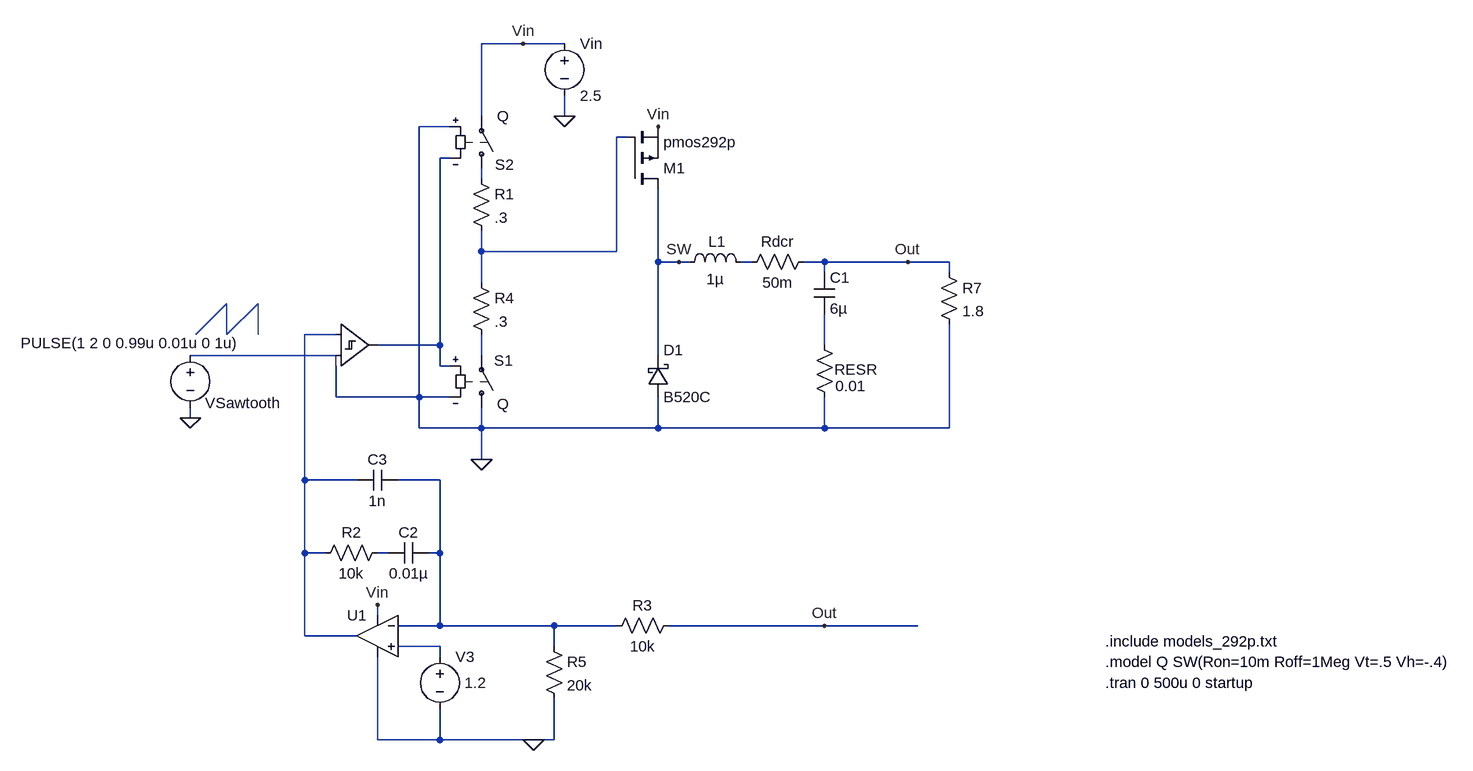
[diagram p0: schematic Lec18_Buck.asc]
Lec18_Buck.asc, the LTspice schematic file:
Version 4
SHEET 1 2044 1956
WIRE 528 -272 464 -272
WIRE 592 -272 528 -272
WIRE 464 -160 464 -272
WIRE 592 -160 592 -192
WIRE 416 -144 368 -144
WIRE 688 -128 672 -128
WIRE 416 -96 400 -96
WIRE 464 -64 464 -80
WIRE 464 48 464 16
WIRE 672 48 672 -128
WIRE 672 48 464 48
WIRE 736 64 736 -48
WIRE 768 64 736 64
WIRE 784 64 768 64
WIRE 880 64 864 64
WIRE 992 64 960 64
WIRE 1120 64 992 64
WIRE 1184 64 1120 64
WIRE 992 80 992 64
WIRE 1184 80 1184 64
WIRE 464 96 464 48
WIRE 240 176 192 176
WIRE 400 192 400 -96
WIRE 400 192 304 192
WIRE 992 192 992 144
WIRE 240 208 16 208
WIRE 464 208 464 176
WIRE 736 208 736 64
WIRE 400 224 400 192
WIRE 416 224 400 224
WIRE 240 272 240 224
WIRE 368 272 368 -144
WIRE 368 272 240 272
WIRE 416 272 368 272
WIRE 16 304 16 288
WIRE 368 320 368 272
WIRE 464 320 464 288
WIRE 464 320 368 320
WIRE 736 320 736 272
WIRE 736 320 464 320
WIRE 992 320 992 272
WIRE 992 320 736 320
WIRE 1184 320 1184 160
WIRE 1184 320 992 320
WIRE 464 368 464 320
WIRE 192 400 192 176
WIRE 272 400 192 400
WIRE 400 400 336 400
WIRE 192 512 192 400
WIRE 224 512 192 512
WIRE 320 512 304 512
WIRE 400 512 400 400
WIRE 400 512 384 512
WIRE 304 608 304 592
WIRE 400 624 400 512
WIRE 400 624 336 624
WIRE 576 624 400 624
WIRE 672 624 576 624
WIRE 992 624 752 624
WIRE 1136 624 992 624
WIRE 192 640 192 512
WIRE 272 640 192 640
WIRE 400 656 336 656
WIRE 576 656 576 624
WIRE 400 672 400 656
WIRE 304 800 304 672
WIRE 400 800 400 752
WIRE 400 800 304 800
WIRE 544 800 400 800
WIRE 576 800 576 736
WIRE 576 800 544 800
FLAG 464 368 0
FLAG 304 592 Vin
FLAG 736 -144 Vin
FLAG 1120 64 Out
FLAG 768 64 SW
FLAG 592 -160 0
FLAG 544 800 0
FLAG 992 624 Out
FLAG 16 304 0
FLAG 528 -272 Vin
SYMBOL voltage 16 192 R0
WINDOW 123 0 0 Left 2
WINDOW 39 0 0 Left 2
WINDOW 3 -261 -3 Left 2
WINDOW 0 23 89 Left 2
SYMATTR Value PULSE(1 2 0 0.99u 0.01u 0 1u)
SYMATTR InstName VSawtooth
SYMBOL sw 464 304 M180
WINDOW 0 19 88 Left 2
WINDOW 3 24 21 Left 2
SYMATTR InstName S1
SYMATTR Value Q
SYMBOL sw 464 -64 M180
WINDOW 0 21 22 Left 2
SYMATTR InstName S2
SYMATTR Value Q
SYMBOL Digital\\diffschmtbuf 240 128 R0
WINDOW 3 26 94 Invisible 2
WINDOW 0 8 16 Invisible 2
SYMATTR Value Vt=0 Vh=0
SYMATTR InstName A2
SYMATTR SpiceLine Trise=10n
SYMATTR SpiceLine2 tripdt=2n
SYMATTR Value2 Vlow=-1
SYMBOL ind 768 80 R270
WINDOW 0 32 59 VTop 2
WINDOW 3 5 56 VBottom 2
SYMATTR InstName L1
SYMATTR Value 1µ
SYMBOL voltage 400 656 R0
WINDOW 3 38 56 Left 2
WINDOW 123 0 0 Left 2
WINDOW 39 0 0 Left 2
SYMATTR Value 1.2
SYMATTR InstName V3
SYMBOL cap 976 80 R0
SYMATTR InstName C1
SYMATTR Value 6µ
SYMBOL res 320 496 R90
WINDOW 0 0 56 VBottom 2
WINDOW 3 32 56 VTop 2
SYMATTR InstName R2
SYMATTR Value 10k
SYMBOL res 768 608 R90
WINDOW 0 0 56 VBottom 2
WINDOW 3 32 56 VTop 2
SYMATTR InstName R3
SYMATTR Value 10k
SYMBOL cap 384 496 R90
WINDOW 0 0 32 VBottom 2
WINDOW 3 32 32 VTop 2
SYMATTR InstName C2
SYMATTR Value 0.01µ
SYMBOL schottky 720 272 M180
WINDOW 0 24 72 Left 2
WINDOW 3 24 0 Left 2
SYMATTR InstName D1
SYMATTR Value B520C
SYMATTR Description Diode
SYMATTR Type diode
SYMBOL res 448 -80 R0
SYMATTR InstName R1
SYMATTR Value .3
SYMBOL res 448 80 R0
SYMATTR InstName R4
SYMATTR Value .3
SYMBOL voltage 592 -288 R0
SYMATTR InstName Vin
SYMATTR Value 2.5
SYMBOL res 560 640 R0
SYMATTR InstName R5
SYMATTR Value 20k
SYMBOL res 976 176 R0
WINDOW 0 31 54 Left 2
WINDOW 3 33 79 Left 2
SYMATTR InstName RESR
SYMATTR Value 0.01
SYMBOL res 976 48 R90
WINDOW 0 0 56 VBottom 2
WINDOW 3 32 56 VTop 2
SYMATTR InstName Rdcr
SYMATTR Value 50m
SYMBOL cap 336 384 R90
WINDOW 0 0 32 VBottom 2
WINDOW 3 32 32 VTop 2
SYMATTR InstName C3
SYMATTR Value 1n
SYMBOL res 1168 64 R0
SYMATTR InstName R7
SYMATTR Value 1.8
SYMBOL pmos 688 -48 M180
SYMATTR InstName M1
SYMATTR Value pmos292p
SYMATTR SpiceLine l=0.18u W=30000u
SYMBOL OpAmps\\UniversalOpAmp2 304 640 M0
SYMATTR InstName U1
SYMATTR Value2 Avol=1Meg GBW=1G Slew=1G
TEXT 1424 648 Left 2 !.include models_292p.txt
TEXT 1424 680 Left 2 !.model Q SW(Ron=10m Roff=1Meg Vt=.5 Vh=-.4)
TEXT 1424 712 Left 2 !.tran 0 500u 0 startup
LINE Normal 72 128 24 176
LINE Normal 72 176 72 128
LINE Normal 120 128 72 176
LINE Normal 120 176 120 128

The netlist it stands for:
* Lec18_Buck.asc
VSawtooth N007 0 PULSE(1 2 0 0.99u 0.01u 0 1u)
S1 0 N008 N002 0 Q
S2 N003 Vin 0 N002 Q
A2 N005 N007 0 0 0 0 N002 0 SCHMITT Vt=0 Vh=0 Vlow=-1 Trise=10n tripdt=2n
L1 SW N004 1µ
V3 N011 0 1.2
C1 Out N006 6µ
R2 N010 N005 10k
R3 Out N009 10k
C2 N009 N010 0.01µ
D1 0 SW B520C
R1 N003 N001 .3
R4 N001 N008 .3
Vin Vin 0 2.5
R5 N009 0 20k
RESR N006 0 0.01
Rdcr Out N004 50m
C3 N009 N005 1n
R7 Out 0 1.8
M1 SW N001 Vin Vin pmos292p l=0.18u W=30000u
XU1 N011 N009 Vin 0 N005 level2 Avol=1Meg GBW=1G Slew=1G Ilimit=25m Rail=0 Vos=0 En=0 Enk=0 In=0 Ink=0 Rin=500Meg  ; pins In+ In- V+ V- OUT
.model D D
.lib standard.dio
.model NMOS NMOS
.model PMOS PMOS
.lib standard.mos
.include models_292p.txt
.model Q SW(Ron=10m Roff=1Meg Vt=.5 Vh=-.4)
.tran 0 500u 0 startup
.lib UniversalOpAmp2.lib
.backanno
.end